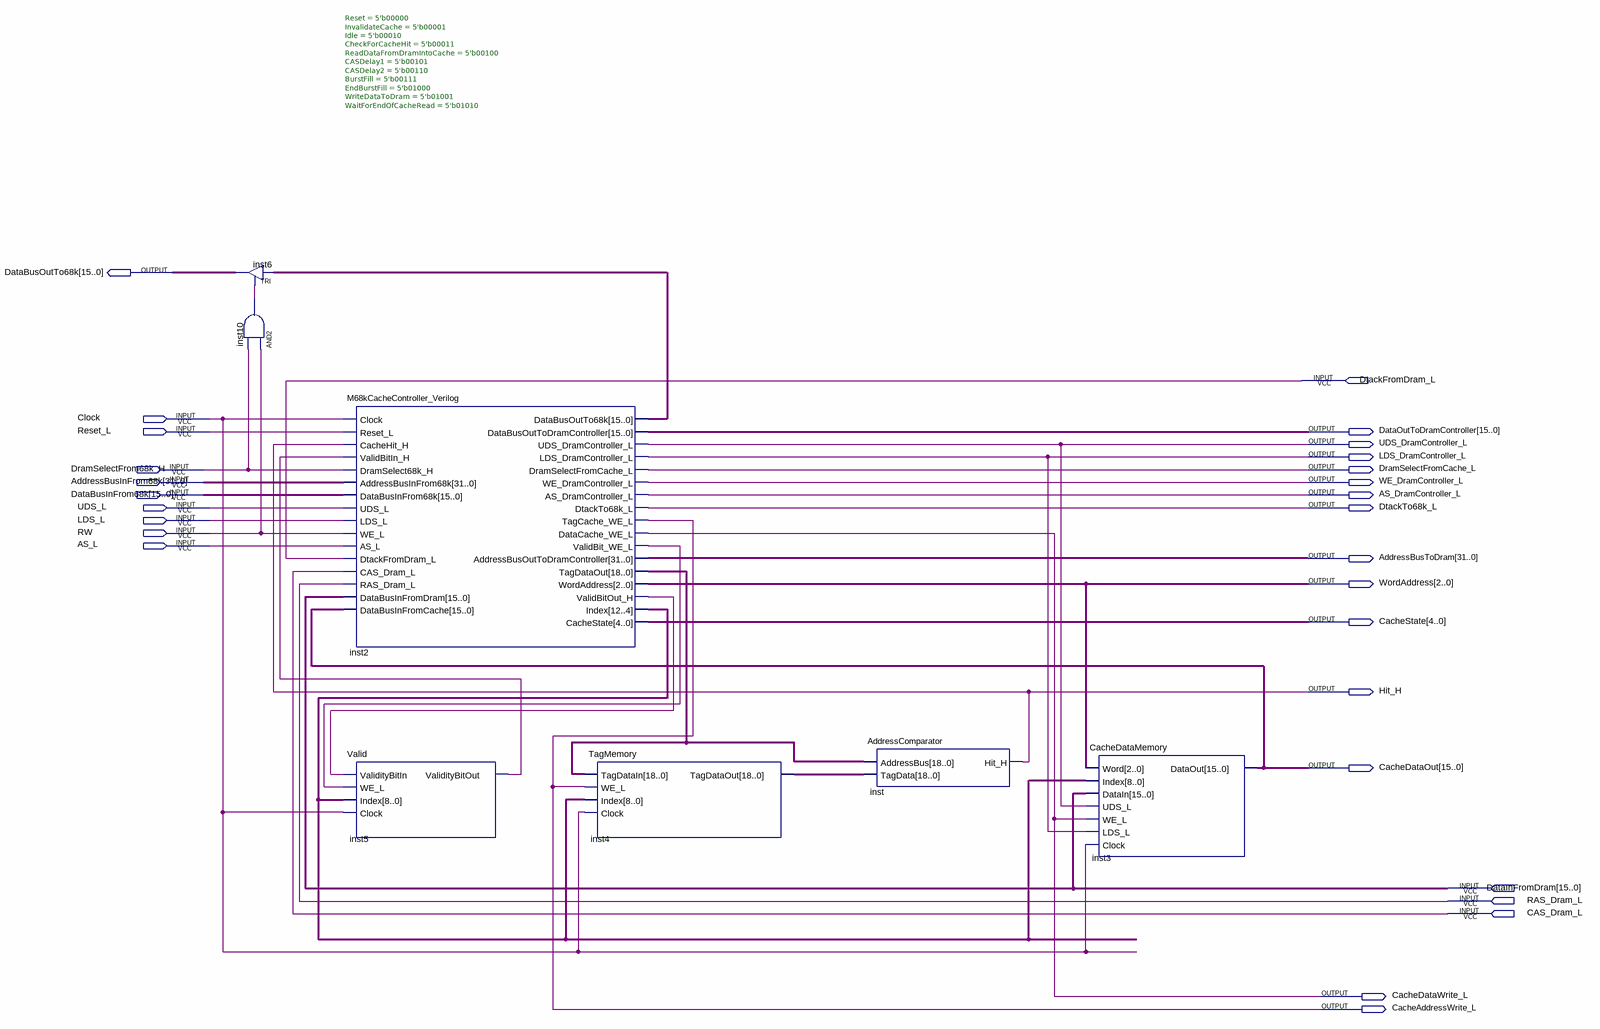
[diagram p0: schematic sheet]
// Quartus schematic DramCache.bdf as structural Verilog: 7 symbols, 28 pins
module DramCache (
  input  DtackFromDram_L,
  input  Clock,
  input  Reset_L,
  input  DramSelectFrom68k_H,
  input  [31:0] AddressBusInFrom68k,
  input  [15:0] DataBusInFrom68k,
  input  UDS_L,
  input  LDS_L,
  input  RW,
  input  AS_L,
  input  [15:0] DataInFromDram,
  input  RAS_Dram_L,
  input  CAS_Dram_L,
  output [15:0] DataBusOutTo68k,
  output [15:0] DataOutToDramController,
  output UDS_DramController_L,
  output LDS_DramController_L,
  output DramSelectFromCache_L,
  output WE_DramController_L,
  output AS_DramController_L,
  output DtackTo68k_L,
  output [31:0] AddressBusToDram,
  output [2:0] WordAddress,
  output [4:0] CacheState,
  output Hit_H,
  output [15:0] CacheDataOut,
  output CacheDataWrite_L,
  output CacheAddressWrite_L
);

  wire inst2_validbit_we_l, inst2_validbitout_h, inst5_validitybitout, inst10_out;
  wire [8:0] inst2_index;
  wire [15:0] inst2_databusoutto68k;
  wire [18:0] inst2_tagdataout, inst4_tagdataout;

  TRI inst6[15:0] (.IN(inst2_databusoutto68k), .OE(inst10_out), .OUT(DataBusOutTo68k));
  and inst10 (inst10_out, RW, DramSelectFrom68k_H);
  M68kCacheController_Verilog #(.Reset(5'b00000), .InvalidateCache(5'b00001), .Idle(5'b00010), .CheckForCacheHit(5'b00011), .ReadDataFromDramIntoCache(5'b00100), .CASDelay1(5'b00101), .CASDelay2(5'b00110), .BurstFill(5'b00111), .EndBurstFill(5'b01000), .WriteDataToDram(5'b01001), .WaitForEndOfCacheRead(5'b01010)) inst2 (
    .Clock(Clock), .Reset_L(Reset_L), .CacheHit_H(Hit_H), .ValidBitIn_H(inst5_validitybitout),
    .DramSelect68k_H(DramSelectFrom68k_H), .AddressBusInFrom68k(AddressBusInFrom68k),
    .DataBusInFrom68k(DataBusInFrom68k), .UDS_L(UDS_L), .LDS_L(LDS_L), .WE_L(RW), .AS_L(AS_L),
    .DtackFromDram_L(DtackFromDram_L), .CAS_Dram_L(CAS_Dram_L), .RAS_Dram_L(RAS_Dram_L),
    .DataBusInFromDram(DataInFromDram), .DataBusInFromCache(CacheDataOut),
    .DataBusOutTo68k(inst2_databusoutto68k), .DataBusOutToDramController(DataOutToDramController),
    .UDS_DramController_L(UDS_DramController_L), .LDS_DramController_L(LDS_DramController_L),
    .DramSelectFromCache_L(DramSelectFromCache_L), .WE_DramController_L(WE_DramController_L),
    .AS_DramController_L(AS_DramController_L), .DtackTo68k_L(DtackTo68k_L),
    .TagCache_WE_L(CacheAddressWrite_L), .DataCache_WE_L(CacheDataWrite_L),
    .ValidBit_WE_L(inst2_validbit_we_l), .AddressBusOutToDramController(AddressBusToDram),
    .TagDataOut(inst2_tagdataout), .WordAddress(WordAddress), .ValidBitOut_H(inst2_validbitout_h),
    .Index(inst2_index), .CacheState(CacheState));
  Valid inst5 (
    .ValidityBitIn(inst2_validbitout_h), .WE_L(inst2_validbit_we_l), .Index(inst2_index), .Clock(Clock),
    .ValidityBitOut(inst5_validitybitout));
  TagMemory inst4 (
    .TagDataIn(inst2_tagdataout), .WE_L(CacheAddressWrite_L), .Index(inst2_index), .Clock(Clock),
    .TagDataOut(inst4_tagdataout));
  AddressComparator inst (.AddressBus(inst2_tagdataout), .TagData(inst4_tagdataout), .Hit_H(Hit_H));
  CacheDataMemory inst3 (
    .Word(WordAddress), .Index(inst2_index), .DataIn(DataInFromDram), .UDS_L(UDS_DramController_L),
    .WE_L(CacheDataWrite_L), .LDS_L(LDS_DramController_L), .Clock(Clock), .DataOut(CacheDataOut));
endmodule
